# EAGLE design Demo (EAGLE 7.6.0)
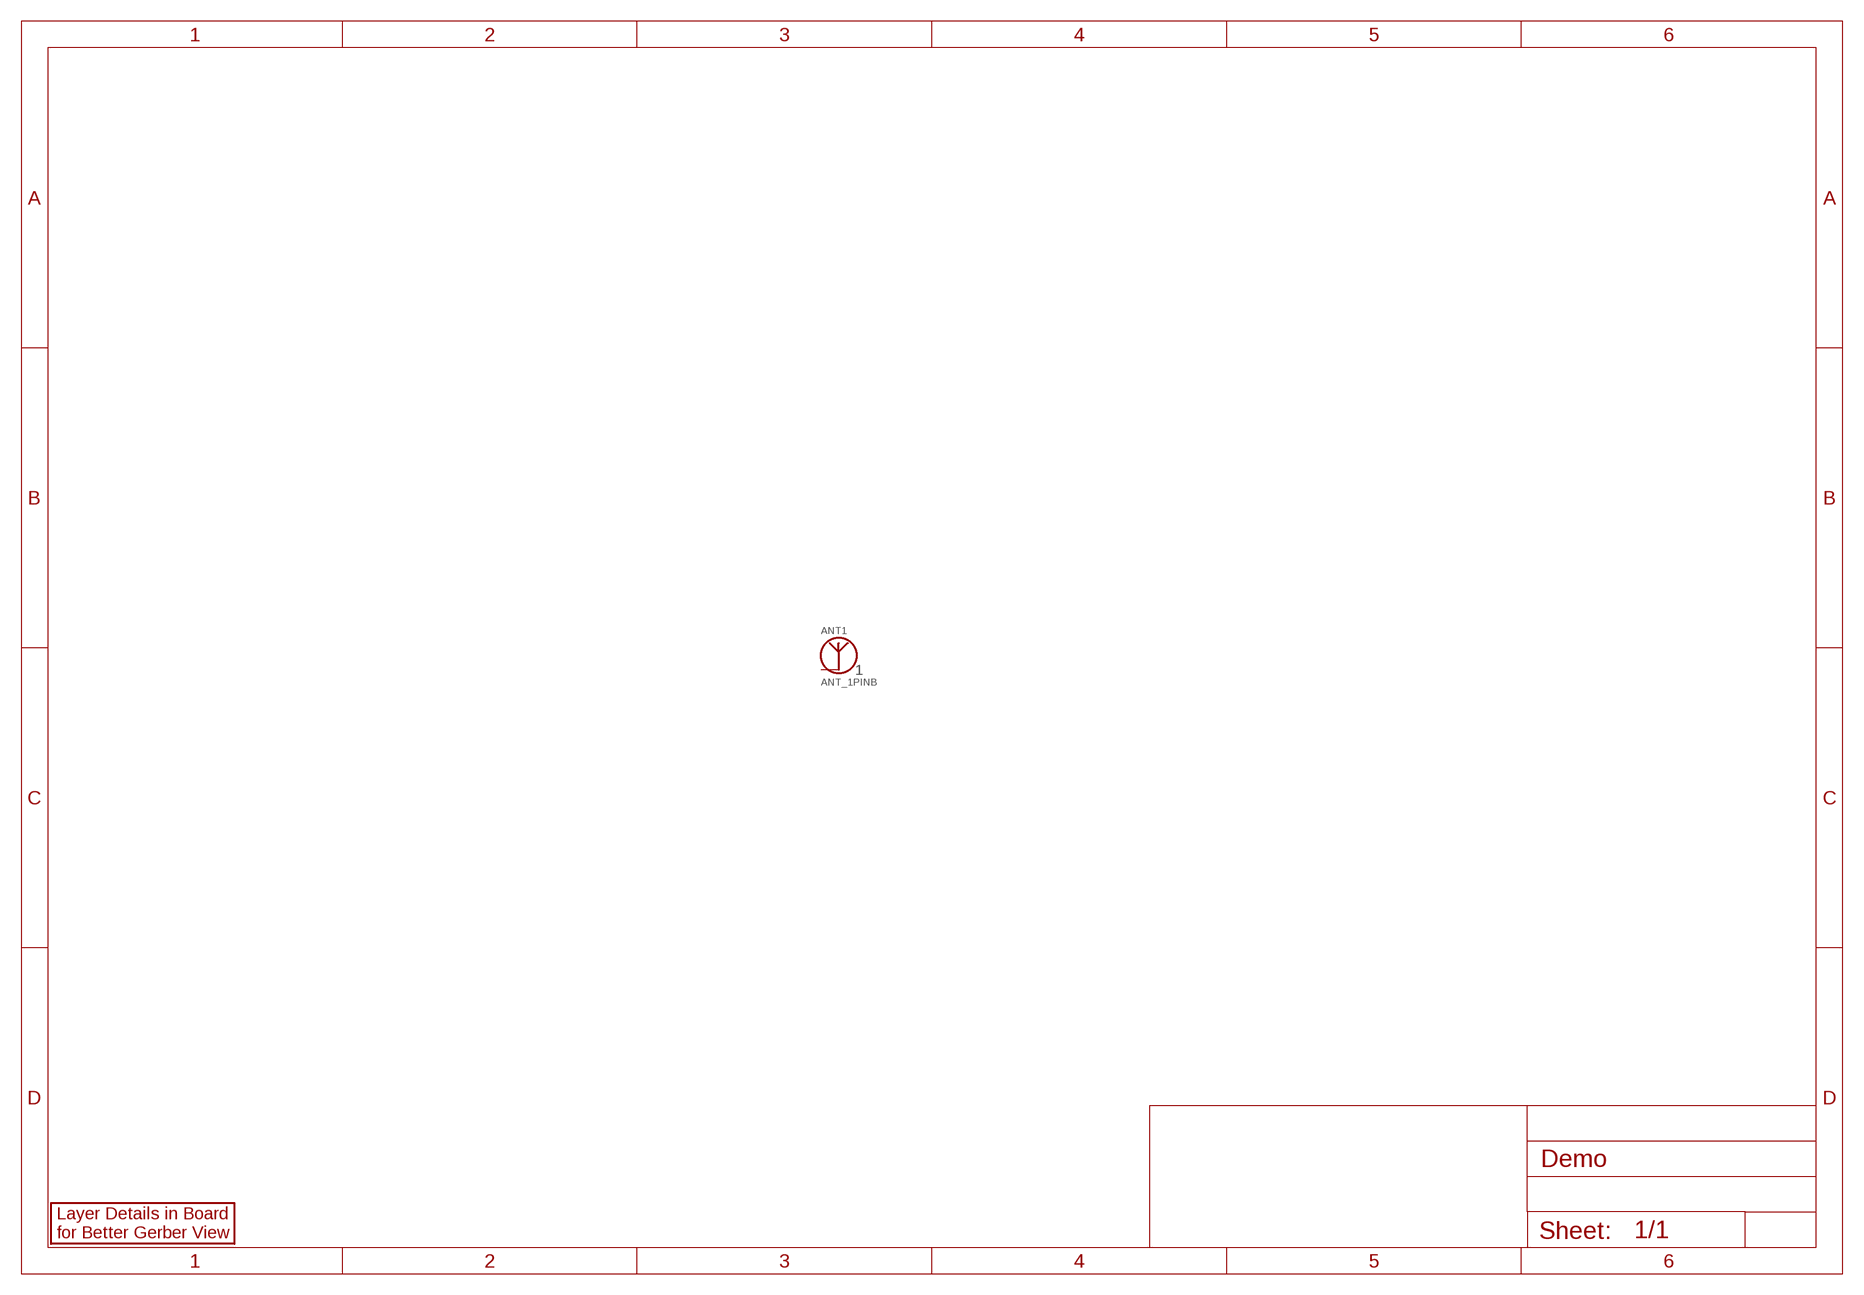
[diagram p0: schematic, sheet 1]

## Parts
ANT1  ANT_1PINB  [PCB_ANT_3]
LAYERS1  LAYERS  [LAYERS]
Unconnected: ANT1.1

## Library data of the parts
ANT1 = M9J_RF:ANT_1PIN
LAYERS1 = M9J_Misc:LAYERS

## Board
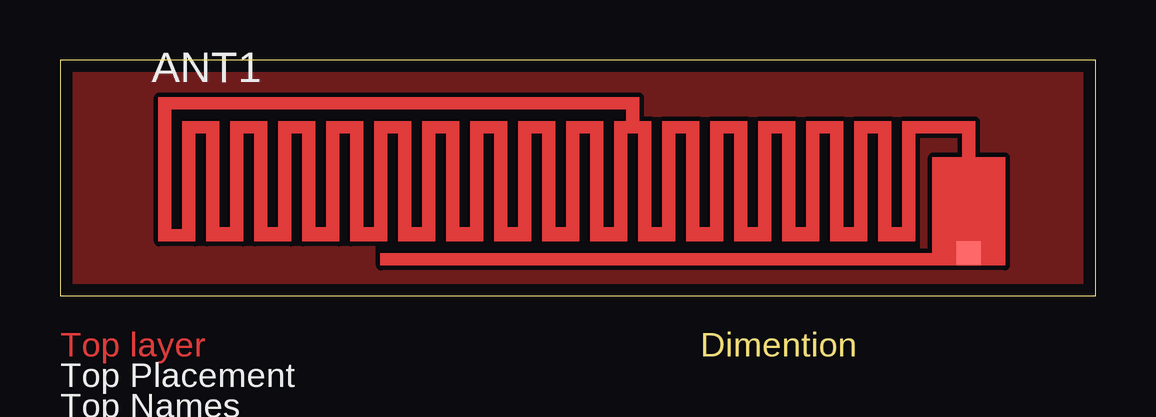
[diagram p1: board, top side]
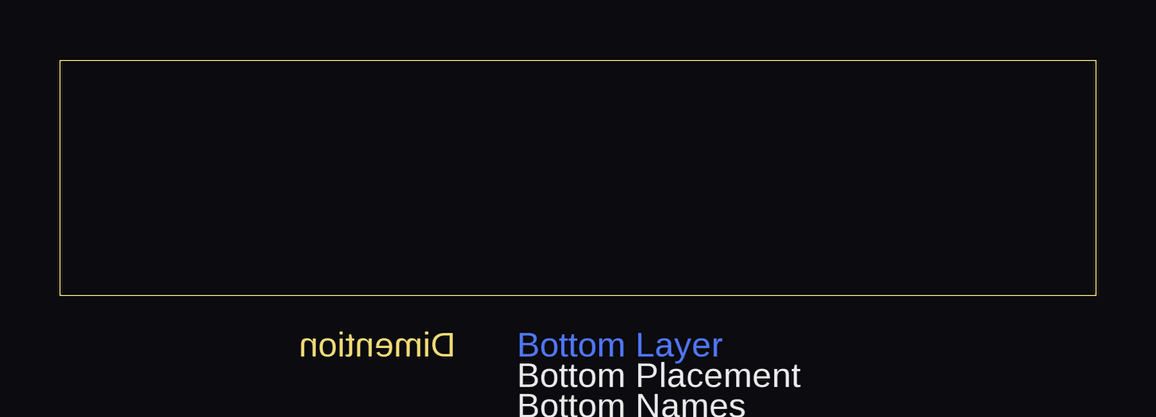
[diagram p2: board, bottom side, seen from below]

Size 43.16 x 9.83 mm. Coordinates in mm from the lower left corner, seen from the top.
Outline: 0,0 43.16,0 43.16,9.83 0,9.83 0,0
Copper layers (1*16): Top 0.035mm / dielectric 1.5mm / Bottom 0.035mm
Design rules "default *": minimum track width 0.2mm, minimum drill 24mil, track to track 0.2mm, track to pad 0.2mm, pad to pad 0.2mm, via to via 0.2mm, smd to smd 0mil, copper to edge 0.5mm, drill to drill 0.5mm, minimum pad ring 10mil, minimum via ring 8mil, stop-mask expansion 4mil, vias tented up to drill 0mil, thermal gap 10mil

### Footprints (pad centres in the part's own frame; a part is rotated, then mirrored left to right if it is on the bottom)
PCB_ANT_3 = smd 1 x 1: 1 -1.5,0.5

### Placement (x,y rotation side)
ANT1  39.37,1.27 0 top
LAYERS1  0,-1.27 0 top

### Tracks (layer width: path | path; a pad name or v marks a point on that pad's centre or on a via)
N$1
  pour Top: 0,0 0,10.16 43.18,10.16 43.18,0